# Altium schematic sheet datalogger.SchDoc
size A3; Organization: Altium Limited; Address1: L3, 12a Rodborough Rd; Address2: Frenchs Forest; Address3: NSW; Address4: Australia 2086
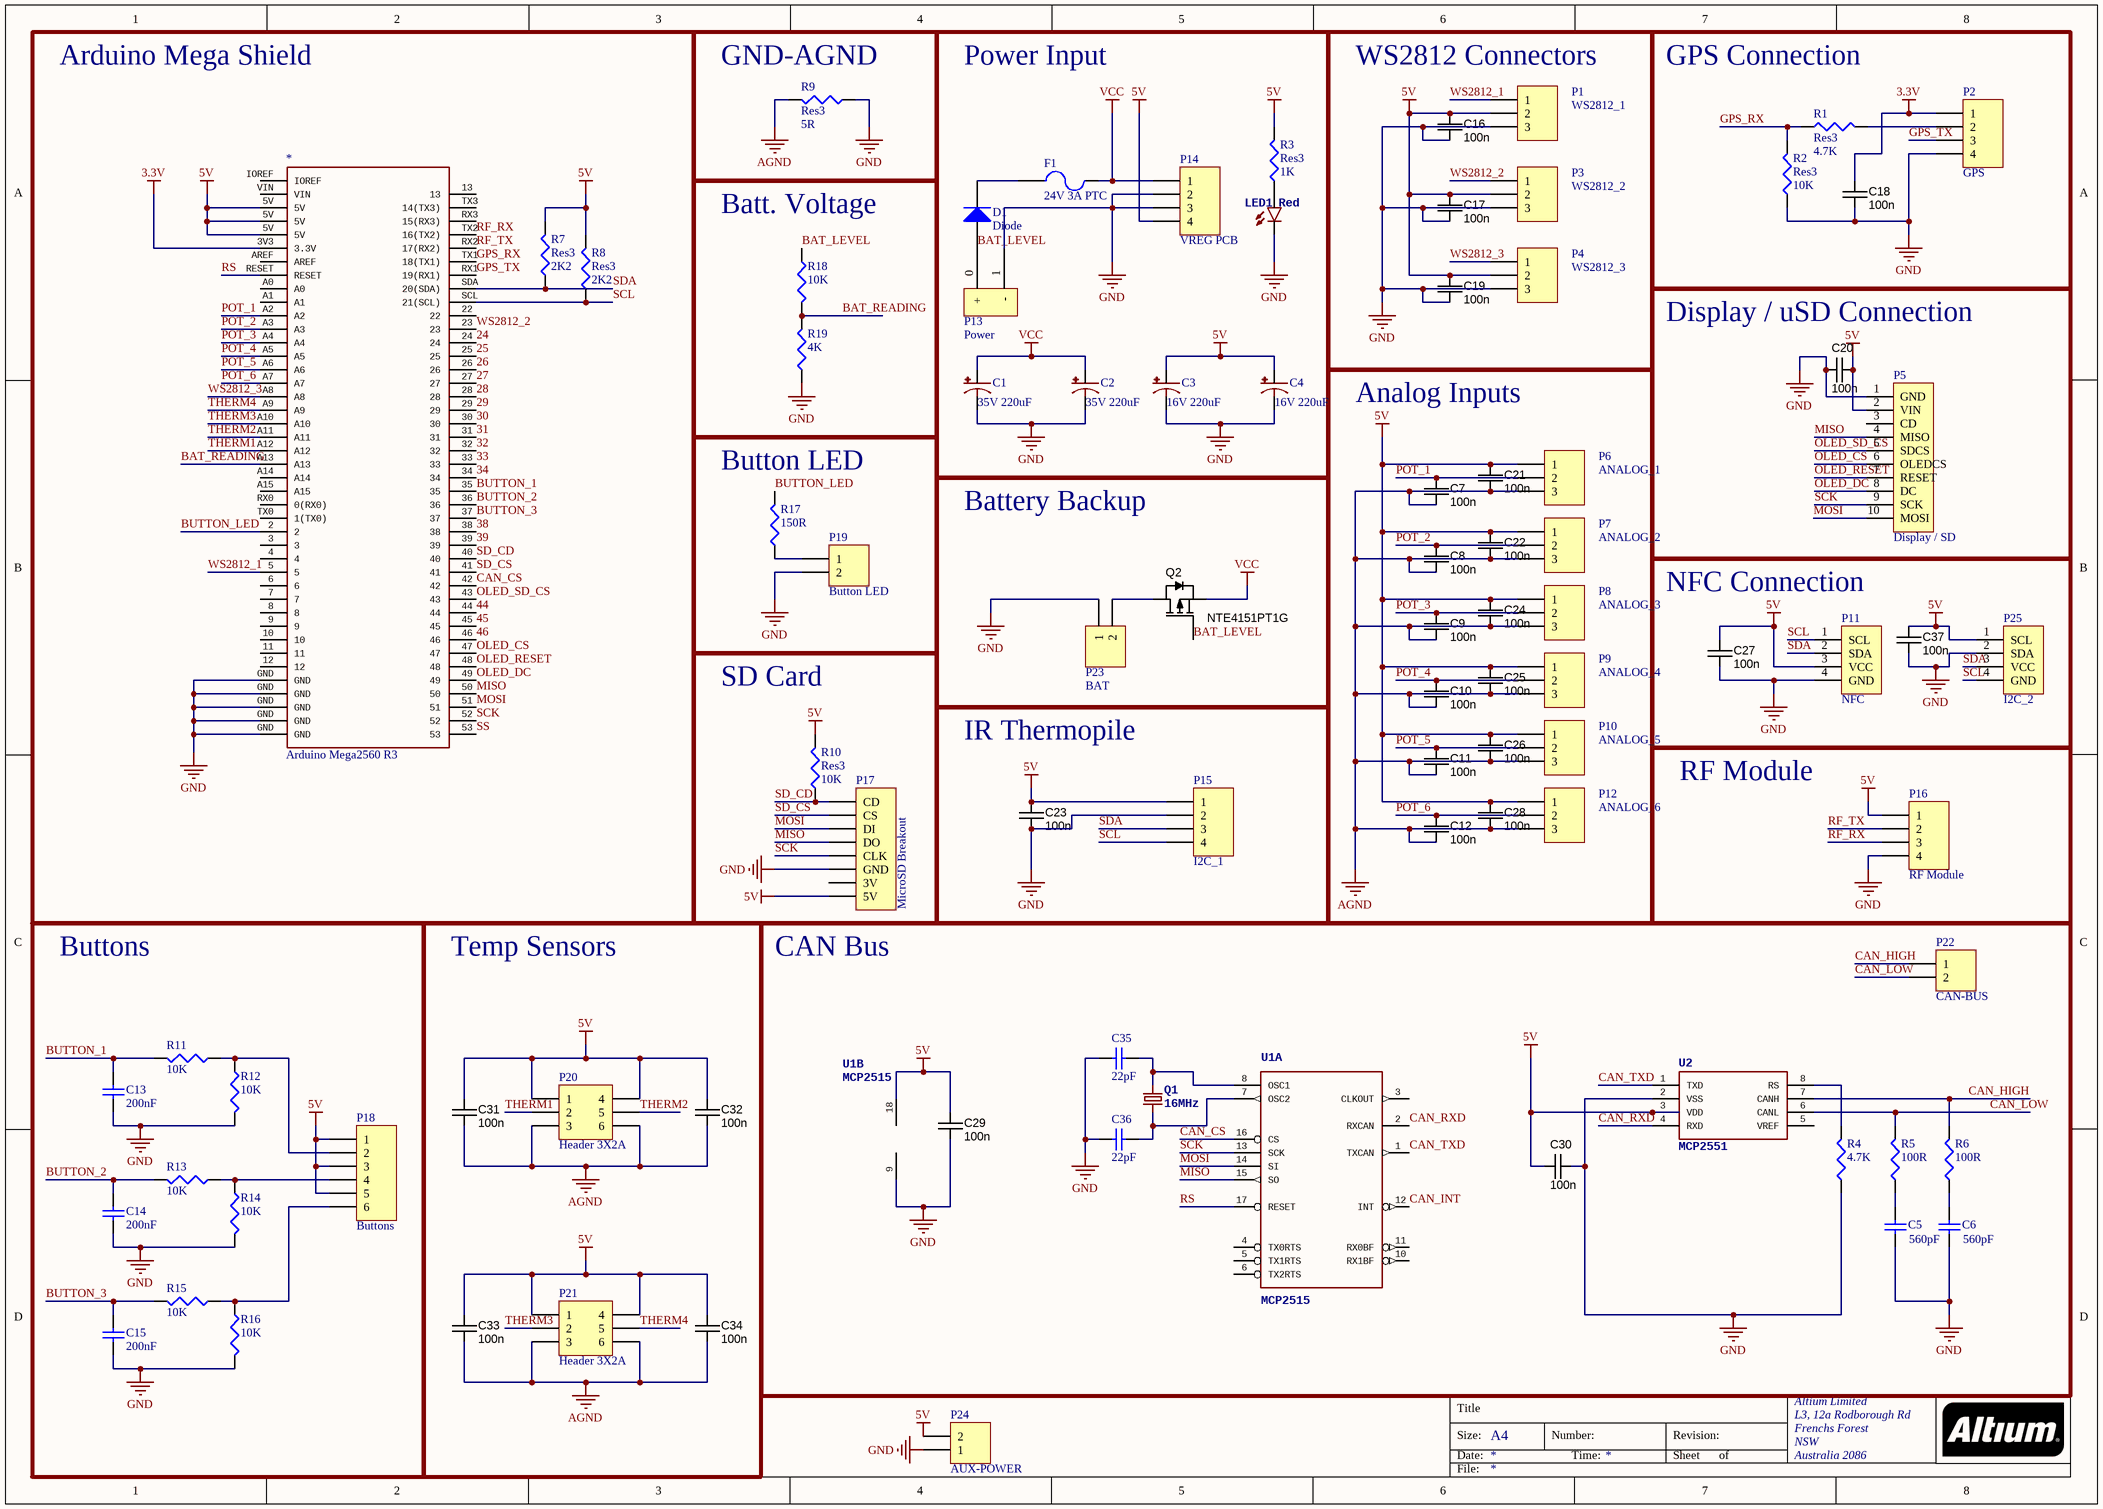
[diagram p0: datalogger.SchDoc]

## Parts
*  Arduino Mega2560 R3  [Arduino Mega Shield - No Text]
C1  35V 220uF  [8-DIA-CAP-3.5mm-Leads]
C2  35V 220uF  [8-DIA-CAP-3.5mm-Leads]
C3  16V 220uF  [6.3-DIA-CAP]
C4  16V 220uF  [6.3-DIA-CAP]
C5  value 560pF  [1608[0603]]  (hidden comment: Cap Ceramic)
C6  value 560pF  [1608[0603]]  (hidden comment: Cap Ceramic)
C7  value 100n  [CAPC1608X90N]  (hidden comment: approved sub OK)
C8  value 100n  [CAPC1608X90N]  (hidden comment: approved sub OK)
C9  value 100n  [CAPC1608X90N]  (hidden comment: approved sub OK)
C10  value 100n  [CAPC1608X90N]  (hidden comment: approved sub OK)
C11  value 100n  [CAPC1608X90N]  (hidden comment: approved sub OK)
C12  value 100n  [CAPC1608X90N]  (hidden comment: approved sub OK)
C13  value 200nF  [1608[0603]]  (hidden comment: Cap Ceramic)
C14  value 200nF  [1608[0603]]  (hidden comment: Cap Ceramic)
C15  value 200nF  [1608[0603]]  (hidden comment: Cap Ceramic)
C16  value 100n  [CAPC1608X90N]  (hidden comment: approved sub OK)
C17  value 100n  [CAPC1608X90N]  (hidden comment: approved sub OK)
C18  value 100n  [CAPC1608X90N]  (hidden comment: approved sub OK)
C19  value 100n  [CAPC1608X90N]  (hidden comment: approved sub OK)
C20  value 100n  [CAPC1608X90N]  (hidden comment: approved sub OK)
C21  value 100n  [CAPC1608X90N]  (hidden comment: approved sub OK)
C22  value 100n  [CAPC1608X90N]  (hidden comment: approved sub OK)
C23  value 100n  [CAPC1608X90N]  (hidden comment: approved sub OK)
C24  value 100n  [CAPC1608X90N]  (hidden comment: approved sub OK)
C25  value 100n  [CAPC1608X90N]  (hidden comment: approved sub OK)
C26  value 100n  [CAPC1608X90N]  (hidden comment: approved sub OK)
C27  value 100n  [CAPC1608X90N]  (hidden comment: approved sub OK)
C28  value 100n  [CAPC1608X90N]  (hidden comment: approved sub OK)
C29  value 100n  [CAPC1608X90N]  (hidden comment: approved sub OK)
C30  value 100n  [CAPC1608X90N]  (hidden comment: approved sub OK)
C31  value 100n  [CAPC1608X90N]  (hidden comment: approved sub OK)
C32  value 100n  [CAPC1608X90N]  (hidden comment: approved sub OK)
C33  value 100n  [CAPC1608X90N]  (hidden comment: approved sub OK)
C34  value 100n  [CAPC1608X90N]  (hidden comment: approved sub OK)
C35  value 22pF  [1608[0603]]  (hidden comment: Cap Ceramic)
C36  value 22pF  [1608[0603]]  (hidden comment: Cap Ceramic)
C37  value 100n  [CAPC1608X90N]  (hidden comment: approved sub OK)
D1  Diode  [SMC]
F1  24V 3A PTC  [MF-LSMF SMD PTC Fuse]
LED1  Red  [LED-0603]
P1  WS2812_1  [HDR1X3]
P2  GPS  [HDR1X4]
P3  WS2812_2  [HDR1X3]
P4  WS2812_3  [HDR1X3]
P5  Display / SD  [HDR1X10]
P6  ANALOG_1  [HDR1X3]
P7  ANALOG_2  [HDR1X3]
P8  ANALOG_3  [HDR1X3]
P9  ANALOG_4  [HDR1X3]
P10  ANALOG_5  [HDR1X3]
P11  NFC  [HDR1X4]
P12  ANALOG_6  [HDR1X3]
P13  Power  [2P 5.08mm Screw Terminal]
P14  VREG PCB  [HDR1X4]
P15  I2C_1  [HDR1X4]
P16  RF Module  [HDR1X4]
P17  MicroSD Breakout  [HDR1X8]
P18  Buttons  [HDR1X6]
P19  Button LED  [HDR1X2]
P20  Header 3X2A  [HDR2X3_CEN]
P21  Header 3X2A  [HDR2X3_CEN]
P22  CAN-BUS  [HDR1X2]
P23  BAT  [HDR1X2]
P24  AUX-POWER  [HDR1X2]
P25  I2C_2  [HDR1X4]
Q1  16MHz  [HC-46X]
Q2  Manufacturer Part Number 1: NTE4151PT1G  [SOT23-3]  (hidden comment: P-Channel)
R1  Res3  value 4.7K  [J1-0603]
R2  Res3  value 10K  [J1-0603]
R3  Res3  value 1K  [J1-0603]
R4  4.7K  [J1-0603]
R5  100R  [J1-0603]
R6  100R  [J1-0603]
R7  Res3  value 2K2  [J1-0603]
R8  Res3  value 2K2  [J1-0603]
R9  Res3  value 5R  [0805]
R10  Res3  value 10K  [J1-0603]
R11  10K  [J1-0603]
R12  10K  [J1-0603]
R13  10K  [J1-0603]
R14  10K  [J1-0603]
R15  10K  [J1-0603]
R16  10K  [J1-0603]
R17  150R  [J1-0603]
R18  10K  [J1-0603]
R19  4K  [J1-0603]
U1  MCP2515  [SO-18W]  (parts A,B of 2)
U2  MCP2551  [SO08]

## Blocks framed on the sheet
Arduino Mega Shield: * R7 R8
GND-AGND: R9
Power Input: C1-C4 D1 F1 LED1 P13 P14 R3
WS2812 Connectors: C16 C17 C19 P1 P3 P4
GPS Connection: C18 P2 R1 R2
Batt. Voltage: R18 R19
Display / uSD Connection: C20 P5
Analog Inputs: C7-C12 C21 C22 C24-C26 C28 P6-P10 P12
Button LED: P19 R17
Battery Backup: P23 Q2
NFC Connection: C27 C37 P11 P25
SD Card: P17 R10
IR Thermopile: C23 P15
RF Module: P16
Buttons: C13-C15 P18 R11-R16
Temp Sensors: C31-C34 P20 P21
CAN Bus: C5 C6 C29 C30 C35 C36 P22 Q1 R4-R6 U1 U2

## Nets
3.3V: *.3V3(3.3V) C18.1 P2.1
5V: *.5V C3.2(+) C4.2(+) C16.1 C17.1 C19.1 C20.2 C21.1 C22.1 C23.1 C24.1 C25.1 C26.1 C27.2 C28.1 C29.1 C30.2 C31.1 C32.1 C33.1 C34.1 C37.2 P1.2 P3.2 P4.2 P5.2(VIN) P6.1 P7.1 P8.1 P9.1 P10.1 P11.3(VCC) P12.1 P14.4 P15.1 P16.1 P17.8(5V) P18.1 P18.3 P18.5 P20.1 P20.4 P21.1 P21.4 P24.2 P25.1(SCL) R3.2 R7.2 R8.2 R10.2 U1.18(VDD) U2.3(VDD)
AGND: C7.2 C8.2 C9.2 C10.2 C11.2 C12.2 C21.2 C22.2 C24.2 C25.2 C26.2 C28.2 C31.2 C32.2 C33.2 C34.2 P6.3 P7.3 P8.3 P9.3 P10.3 P12.3 P20.3 P20.6 P21.3 P21.6 R9.2
GND: *.GND C1.1(-) C2.1(-) C3.1(-) C4.1(-) C5.1 C6.1 C13.2 C14.2 C15.2 C16.2 C17.2 C18.2 C19.2 C20.1 C23.2 C27.1 C29.2 C30.1 C35.2 C36.2 C37.1 LED1.C P1.3 P2.4 P3.3 P4.3 P5.1(GND) P11.4(GND) P13.1(-) P14.2 P14.3 P15.2 P16.4 P17.6(GND) P19.2 P23.1 P24.1 P25.2(SDA) R2.1 R4.1 R9.1 R12.2 R14.2 R16.2 R19.1 U1.9(VSS) U2.2(VSS)
VCC: C1.2(+) C2.2(+) F1.2 P14.1 Q2.2(S)
24: *.24
25: *.25
26: *.26
27: *.27
28: *.28
29: *.29
30: *.30
31: *.31
32: *.32
33: *.33
34: *.34
38: *.38
39: *.39
44: *.44
45: *.45
46: *.46
BAT_LEVEL: D1.1(A) P13.0(+) Q2.1(G) R18.1
BAT_READING: *.A13 R18.2 R19.2
BUTTON_1: *.35 C13.1 R11.2
BUTTON_2: *.36 C14.1 R13.2
BUTTON_3: *.37 C15.1 R15.2
BUTTON_LED: *.2 R17.2
CAN_CS: *.42 U1.16(CS)
CAN_HIGH: P22.1 R6.2 U2.7(CANH)
CAN_INT: U1.12(INT)
CAN_LOW: P22.2 R5.2 U2.6(CANL)
CAN_RXD: U1.2(RXCAN) U2.4(RXD)
CAN_TXD: U1.1(TXCAN) U2.1(TXD)
GPS_RX: *.TX1(18(TX1)) R1.1 R2.2
GPS_TX: *.RX1(19(RX1)) P2.3
MISO: *.50 P5.4(MISO) P17.4(DO) U1.15(SO)
MOSI: *.51 P5.10(MOSI) P17.3(DI) U1.14(SI)
OLED_CS: *.47 P5.6(OLEDCS)
OLED_DC: *.49 P5.8(DC)
OLED_RESET: *.48 P5.7(RESET)
OLED_SD_CS: *.43 P5.5(SDCS)
POT_1: *.A2 C7.1 P6.2
POT_2: *.A3 C8.1 P7.2
POT_3: *.A4 C9.1 P8.2
POT_4: *.A5 C10.1 P9.2
POT_5: *.A6 C11.1 P10.2
POT_6: *.A7 C12.1 P12.2
RF_RX: *.TX2(16(TX2)) P16.3
RF_TX: *.RX2(17(RX2)) P16.2
RS: *.RESET U1.17(RESET)
SCK: *.52 P5.9(SCK) P17.5(CLK) U1.13(SCK)
SCL: *.SCL(21(SCL)) P11.1(SCL) P15.4 P25.4(GND) R8.1
SD_CD: *.40 P17.1(CD) R10.1
SD_CS: *.41 P17.2(CS)
SDA: *.SDA(20(SDA)) P11.2(SDA) P15.3 P25.3(VCC) R7.1
SS: *.53
THERM1: *.A12 P20.2
THERM2: *.A11 P20.5
THERM3: *.A10 P21.2
THERM4: *.A9 P21.5
WS2812_1: *.5 P1.1
WS2812_2: *.23 P3.1
WS2812_3: *.A8 P4.1
NetC5_2: C5.2 R5.1
NetC6_2: C6.2 R6.1
NetC35_1: C35.1 Q1.2 U1.8(OSC1)
NetC36_1: C36.1 Q1.1 U1.7(OSC2)
NetD1_2: D1.2(K) F1.1
NetLED1_A: LED1.A R3.1
NetP2_2: P2.2 R1.2
NetP18_2: P18.2 R11.1 R12.1
NetP18_4: P18.4 R13.1 R14.1
NetP18_6: P18.6 R15.1 R16.1
NetP19_1: P19.1 R17.1
NetP23_2: P23.2 Q2.3(D)
NetR4_2: R4.2 U2.8(RS)

Not connected (* = marked no-connect by the designer): * 3 4 6 7 8 9 10 11 12 13 22 A0 A1 A14 A15 AREF IOREF RX0(0(RX0)) RX3(15(RX3)) TX0(1(TX0)) TX3(14(TX3)) VIN; P5 3(CD); P17 7(3V); U1 3(CLKOUT) 4(TX0RTS) 5(TX1RTS) 6(TX2RTS) 10(RX1BF) 11(RX0BF); U2 5(VREF)

## Notes on the sheet
- Title
- Size:
- Date:
- A4
- Number:
- Time:
- Revision:
- Sheet
- of
- File:

## Library data of the parts
C1-C4 = Capacitor 50V 470uF
  C1 C2: Digikey: P5166-ND
  C3 C4: Digikey: P5530-ND
C5 C6 C13-C15 C35 C36 = Cap Semi: Capacitor (Semiconductor SIM Model); Published: 8-Jun-2000; LatestRevisionDate: 29-May-2009; LatestRevisionNote: IPC-7351 Footprint Added.; PackageReference: C1206; Publisher: Altium Limited; PackageDescription: Chip Capacitor
C7-C12 C16-C34 C37 = CAPC_100n_0603_X7R_50V_10%: Capacitor SMD Cer 100nF 10% 50V X7R 0603; Manufacturer 1: AVX Corporation; Manufacturer Part Number 1: 06035C104KAT2A; Ratings: 50V; X7R; Material: ceramic; SCDType: spec; Manufacturer 2: TDK Corporation; Manufacturer Part Number 2: C1608X7R1H104K; Package / Case: 0603 (1608 Metric); Tolerance: ±10%; Supplier 1: Digi-Key; Supplier Part Number 1: 478-5052-1-ND; ComponentLink1URL: http://www.avx.com/docs/Catalogs/cx7r.pdf; ComponentLink1Description: http://www.avx.com/docs/Catalogs/cx7r.pdf; Supplier 2: Digi-Key; Supplier Part Number 2: 445-1314-1-ND; ComponentLink2URL: http://product.tdk.com/capacitor/mlcc/en/documents/mlcc_commercial_general_en.pdf; ComponentLink2Description: http://product.tdk.com/capacitor/mlcc/en/documents/mlcc_commercial_general_en.pdf
D1 = Diode: Default Diode; Published: 8-Jun-2000; LatestRevisionDate: 17-Jul-2002; LatestRevisionNote: Re-released for DXP Platform.; PackageVersion: Sep-1996; PackageReference: SMC; Publisher: Altium Limited; PackageDescription: DO-214-AB/SMC; 2 C-Bend Leads; Body 7.9 x 5.9 mm, inc. leads (LxW); Code_JEDEC: DO-214-AB; DigiKey: S5BC-FDICT-ND
F1 = Fuse 2: Fuse; Published: 8-Jun-2000; LatestRevisionDate: 17-Jul-2002; LatestRevisionNote: Re-released for DXP Platform.; PackageReference: PIN-W2/E2.8; Publisher: Altium Limited; PackageDescription: Thru-Hole; 2 Leads; DigiKey: MF-LSMF300/24X-2CT-ND
LED1 = LED0603: Power Indicator
P1 P3 P4 P6-P10 P12 = Header 3: Header, 3-Pin; LatestRevisionDate: 17-Jul-2002; LatestRevisionNote: Re-released for DXP Platform.; Publisher: Altium Limited
P2 P11 P14-P16 P25 = Header 4: Header, 4-Pin; LatestRevisionDate: 17-Jul-2002; LatestRevisionNote: Re-released for DXP Platform.; Publisher: Altium Limited
P5 = Header 10: Header, 10-Pin; LatestRevisionDate: 17-Jul-2002; LatestRevisionNote: Re-released for DXP Platform.; Publisher: Altium Limited
P13 = 2P Screw Terminal 5.08mm
P17 = Header 8: Header, 8-Pin; LatestRevisionDate: 17-Jul-2002; LatestRevisionNote: Re-released for DXP Platform.; Publisher: Altium Limited
P18 = Header 6: Header, 6-Pin; LatestRevisionDate: 17-Jul-2002; LatestRevisionNote: Re-released for DXP Platform.; Publisher: Altium Limited
P19 P22-P24 = Header 2: Header, 2-Pin; LatestRevisionDate: 17-Jul-2002; LatestRevisionNote: Re-released for DXP Platform.; Publisher: Altium Limited
P20 P21 = Header 3X2A: Header, 3-Pin, Dual row; LatestRevisionDate: 17-Jul-2002; LatestRevisionNote: Re-released for DXP Platform.; Publisher: Altium Limited
Q1 = CRYSTALHC49US
Q2 = MOSFET_P-CH_NTE4151PT1G: MOSFET SMD P-CH 20V 0.76A 0.313W SOT523F; Manufacturer 1: ON Semiconductor; Rds On (Max) @ Id, Vgs: 360 mOhm @ 350mA, 4.5V; Ratings: 20V; 760mA; 313mW; SCDType: source; Value: P-Channel; Package / Case: SC-89, SOT523F; Supplier 1: Digi-Key; Supplier Part Number 1: NTE4151PT1GOSCT-ND; ComponentLink1URL: http://www.onsemi.com/pub_link/Collateral/NTA4151P-D.PDF; ComponentLink1Description: http://www.onsemi.com/pub_link/Collateral/NTA4151P-D.PDF
R1-R19 = Res3: Resistor; Published: 8-Jun-2000; LatestRevisionDate: 29-May-2009; LatestRevisionNote: IPC-7351 Footprint Added.; PackageReference: J1-0603; Publisher: Altium Limited; PackageDescription: Chip Resistor
  R4: Value: 4.7K
  R5 R6: Value: 100R
  R11-R16 R18: Value: 10K
  R17: Value: 150R
  R19: Value: 4K
U1 = MCP2510SO
U2 = MCP2551: PROD_ID: IC-09907